# EAGLE design Apo Board 2017 ATmega328 (EAGLE 7.3.0)
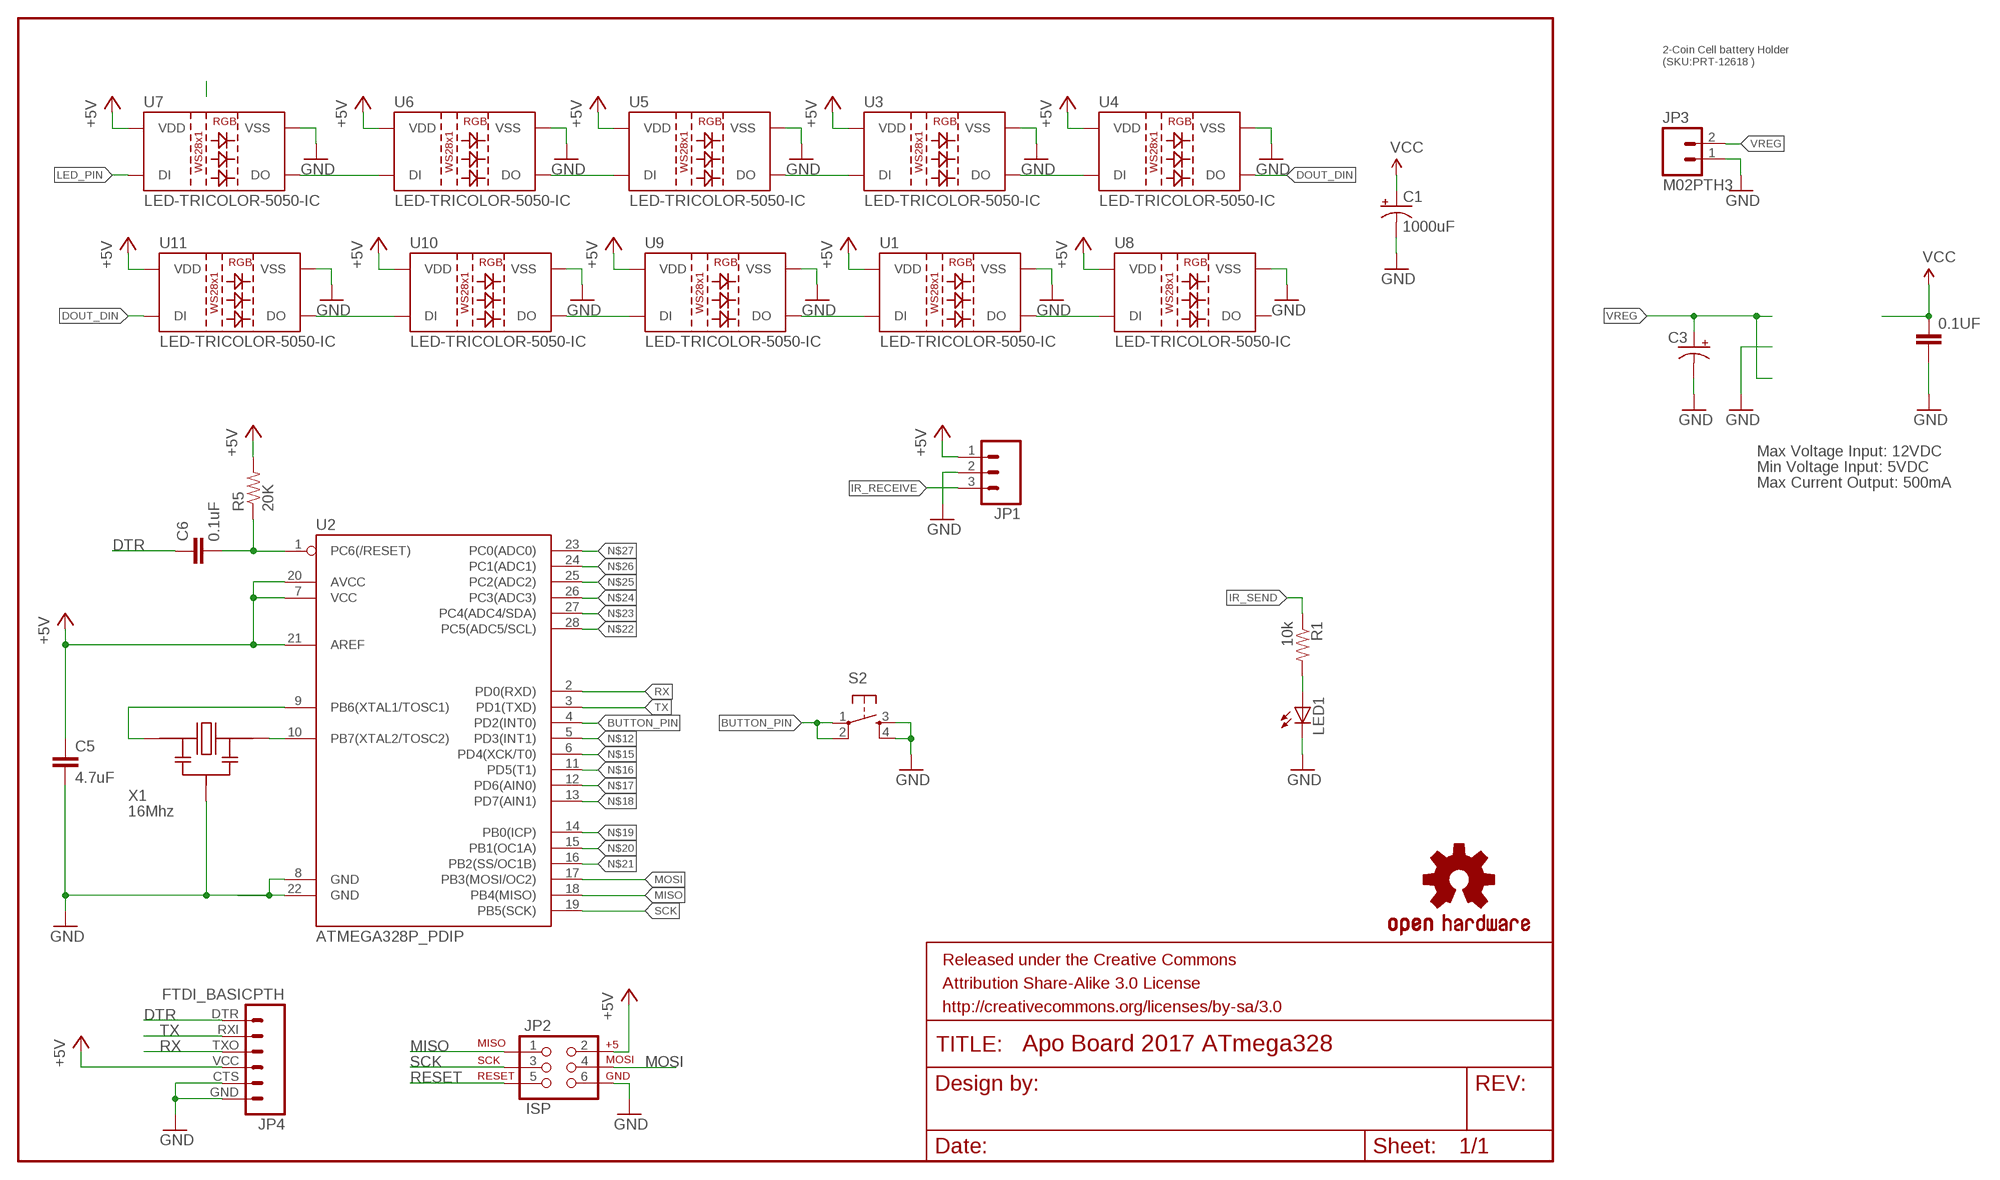
[diagram p0: schematic, sheet 1]

## Parts
0.1UF  CAPKIT  [CAP-PTH-SMALL-KIT]
C1  1000uF  CAP_POLPTH2  [CPOL-RADIAL-10UF-25V]
C3  CAP_POLPTH2  [CPOL-RADIAL-10UF-25V]
C5  4.7uF  CAPKIT  [CAP-PTH-SMALL-KIT]
C6  0.1uF  CAPKIT  [CAP-PTH-SMALL-KIT]
FRAME1  FRAME-LETTER  [CREATIVE_COMMONS]
JP1  M03PTH  [1X03]
JP2  ISP  AVR_SPI_PRG_6PTH  [2X3]
JP3  M02PTH3  [1X02_LONGPADS]
JP4  FTDI_BASICPTH  [FTDI_BASIC]
LED1  LED5MM  [LED5MM]
LOGO1  OSHW-LOGOS  [OSHW-LOGO-S]
R1  10k  RESISTORPTH-1/4W  [AXIAL-0.4]
R5  20K  RESISTORKIT  [AXIAL-0.3-KIT]
S2  TAC_SWITCHPTH  [TACTILE-PTH]
U1  LED-TRICOLOR-5050-IC  [LED-RGB-THRU]
U2  ATMEGA328P_PDIP  [DIL28-3]
U3  LED-TRICOLOR-5050-IC  [LED-RGB-THRU]
U4  LED-TRICOLOR-5050-IC  [LED-RGB-THRU]
U5  LED-TRICOLOR-5050-IC  [LED-RGB-THRU]
U6  LED-TRICOLOR-5050-IC  [LED-RGB-THRU]
U7  LED-TRICOLOR-5050-IC  [LED-RGB-THRU]
U8  LED-TRICOLOR-5050-IC  [LED-RGB-THRU]
U9  LED-TRICOLOR-5050-IC  [LED-RGB-THRU]
U10  LED-TRICOLOR-5050-IC  [LED-RGB-THRU]
U11  LED-TRICOLOR-5050-IC  [LED-RGB-THRU]
X1  16Mhz  CERAMIC_RESONATOR  [CERAMIC_RESONATOR_ZTT]

## Nets
+5V: C5.1 JP1.1 JP2.2 JP4.VCC R5.P$2 U1.2(VDD) U2.7(VCC) U2.20(AVCC) U2.21(AREF) U3.2(VDD) U4.2(VDD) U5.2(VDD) U6.2(VDD) U7.2(VDD) U8.2(VDD) U9.2(VDD) U10.2(VDD) U11.2(VDD)
BUTTON_PIN: S2.1 S2.2 U2.4(PD2(INT0))
DOUT_DIN: U4.4(DO) U11.1(DI)
DTR: C6.1 JP4.DTR
GND: 0.1UF.2 C1.2(-) C3.2(-) C5.2 JP1.2 JP2.6 JP3.1 JP4.CTS JP4.GND LED1.K(C) S2.3 S2.4 U1.3(VSS) U2.8(GND) U2.22(GND) U3.3(VSS) U4.3(VSS) U5.3(VSS) U6.3(VSS) U7.3(VSS) U8.3(VSS) U9.3(VSS) U10.3(VSS) U11.3(VSS) X1.P$2
IR_RECEIVE: JP1.3
IR_SEND: R1.P$1
LED_PIN: U7.1(DI)
MISO: JP2.1 U2.18(PB4(MISO))
MOSI: JP2.4 U2.17(PB3(MOSI/OC2))
N$1: U6.1(DI) U7.4(DO)
N$2: U5.1(DI) U6.4(DO)
N$3: LED1.A R1.P$2
N$4: U2.9(PB6(XTAL1/TOSC1)) X1.P$1
N$5: U3.1(DI) U5.4(DO)
N$6: U3.4(DO) U4.1(DI)
N$7: U2.10(PB7(XTAL2/TOSC2)) X1.P$3
N$9: U10.1(DI) U11.4(DO)
N$10: C6.2 R5.P$1 U2.1(PC6(/RESET))
N$11: U9.1(DI) U10.4(DO)
N$12: U2.5(PD3(INT1))
N$13: U1.1(DI) U9.4(DO)
N$14: U1.4(DO) U8.1(DI)
N$15: U2.6(PD4(XCK/T0))
N$16: U2.11(PD5(T1))
N$17: U2.12(PD6(AIN0))
N$18: U2.13(PD7(AIN1))
N$19: U2.14(PB0(ICP))
N$20: U2.15(PB1(OC1A))
N$21: U2.16(PB2(SS/OC1B))
N$22: U2.28(PC5(ADC5/SCL))
N$23: U2.27(PC4(ADC4/SDA))
N$24: U2.26(PC3(ADC3))
N$25: U2.25(PC2(ADC2))
N$26: U2.24(PC1(ADC1))
N$27: U2.23(PC0(ADC0))
RESET: JP2.5
RX: JP4.TXO U2.2(PD0(RXD))
SCK: JP2.3 U2.19(PB5(SCK))
TX: JP4.RXI U2.3(PD1(TXD))
VCC: 0.1UF.1 C1.1(+)
VREG: C3.1(+) JP3.2
Unconnected: U8.4(DO)

## Notes on the sheet
- 2-Coin Cell battery Holder
  (SKU:PRT-12618 )
- Max Voltage Input: 12VDC
- Min Voltage Input: 5VDC
- Max Current Output: 500mA

## Library data of the parts
0.1UF = SparkFun-Capacitors:CAP: Capacitor Standard 0603 ceramic capacitor, and 0.1" leaded capacitor.
C1 C3 = SparkFun-Capacitors:CAP_POL: Capacitor Polarized These are standard SMD and PTH capacitors. Normally 10uF, 47uF, and 100uF in electrolytic and tantalum varieties. Always verify the external diameter of the through hole cap, it varies with capacity, voltage, and manufacturer. The EIA devices should be standard.
C5 C6 = SparkFun-Passives:CAP: Capacitor Standard 0603 ceramic capacitor, and 0.1" leaded capacitor.
FRAME1 = SparkFun-Aesthetics:FRAME-LETTER: Schematic Frame Standard 8.5x11 US Letter frame
JP1 = SparkFun-Connectors:M03: Header 3 Standard 3-pin 0.1" header. Use with straight break away headers (SKU : PRT-00116), right angle break away headers (PRT-00553), swiss pins (PRT-00743), machine pins (PRT-00117), and female headers (PRT-00115). Molex polarized connector foot print use with SKU : PRT-08232 with associated crimp pins and housings.
JP2 = SparkFun:AVR_SPI_PRG_6: AVR ISP 6 Pin This is the reduced ISP connector for AVR programming. Common on Arduino. This footprint will take up less PCB space and can be used with a 10-pin to 6-pin adapter such as SKU: BOB-08508
JP3 = SparkFun-Connectors:M02: Standard 2-pin 0.1" header. Use with - straight break away headers ( PRT-00116) - right angle break away headers (PRT-00553) - swiss pins (PRT-00743) - machine pins (PRT-00117) - female headers (PRT-00115) Molex polarized connector foot print use with: PRT-08233 with associated crimp pins and housings. 2.54_SCREWTERM for use with PRT-10571. 3.5mm Screw Terminal footprints for PRT-08084 5mm Screw Terminal footprints for use with PRT-08433
JP4 = SparkFun-Connectors:FTDI_BASIC: FTDI Basic header with labels
LED1 = SparkFun-LED:LED: LEDs Standard schematic elements and footprints for 5mm, 3mm, 1206, and 0603 sized LEDs. 5mm - Spark Fun Electronics SKU : COM-00529 (and others)
LOGO1 = SparkFun-Aesthetics:OSHW-LOGO: Open Source Hardware Logo This logo indicates the piece of hardware it is found on incorporates a OSHW license and/or adheres to the definition of open source hardware found here: http://freedomdefined.org/OSHW
R1 = SparkFun-Resistors:RESISTOR: Resistor Basic schematic elements and footprints for 0603, 1206, and PTH resistors.
R5 = SparkFun-Passives:RESISTOR: Resistor Basic schematic elements and footprints for 0603, 1206, and PTH resistors.
S2 = SparkFun-Electromechanical:TAC_SWITCH: Momentary Switch Button commonly used for reset or general input. Spark Fun Electronics SKU : COM-00097 SMT- SWCH-08247
U1 U3-U11 = SparkFun-LED:LED-TRICOLOR-5050-IC: WS2811 RGB LED w/driver 5x5mm SMD LED with built-in controller IC. DIO-11598
U2 = SparkFun-DigitalIC:ATMEGA328P_PDIP: uC used in the Arduino 32kb flash, 1k EEPROM, 2k SRAM This is the through-hole version of this chip.
X1 = 1_Dan Master:CERAMIC_RESONATOR

## Net classes
0 default: width 0.203 mm
3 ButtonSignal: width 0.254 mm

## Board
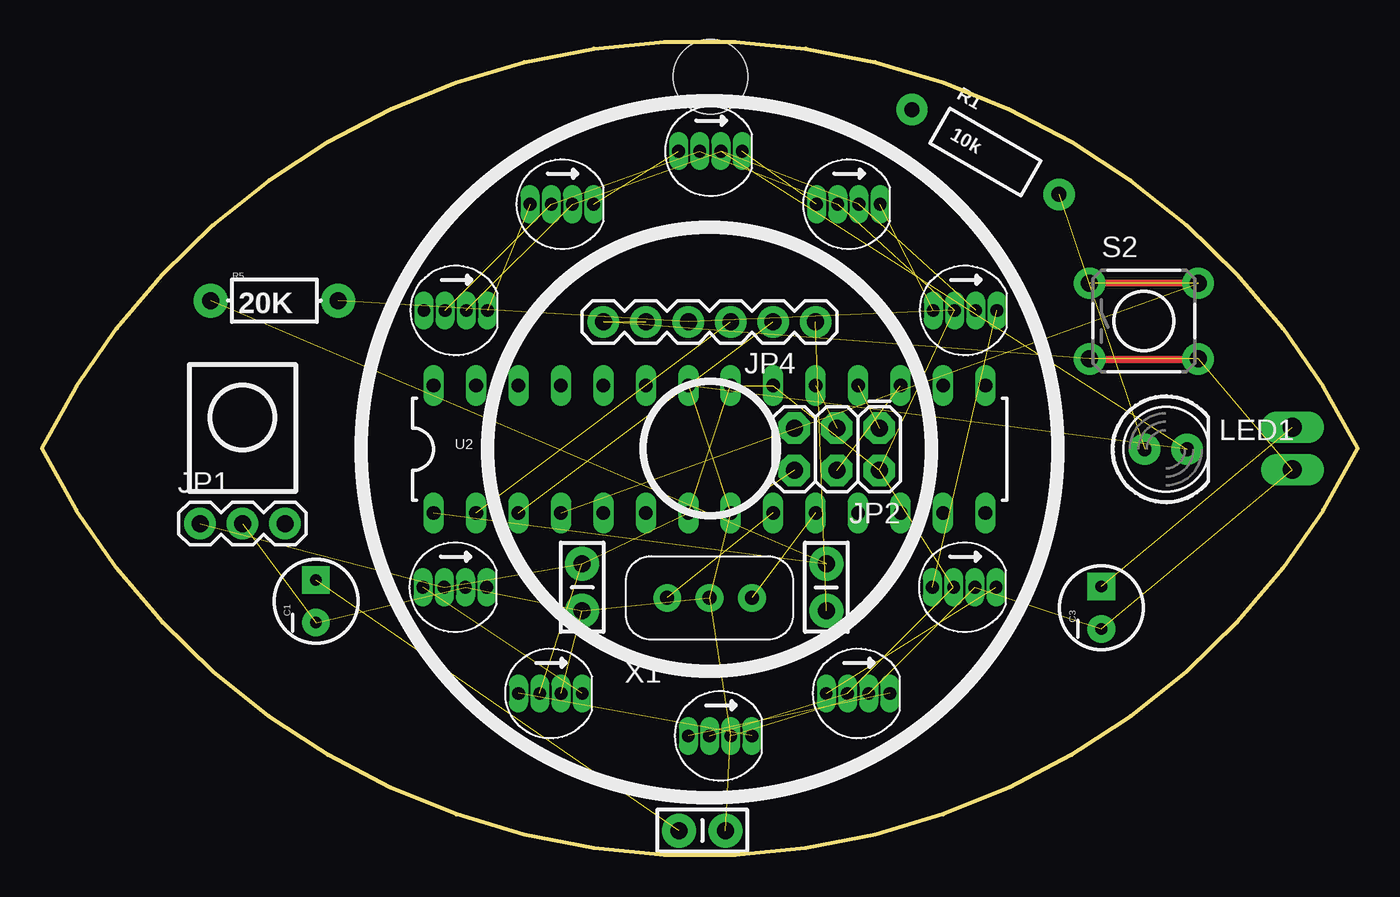
[diagram p1: board, top side]
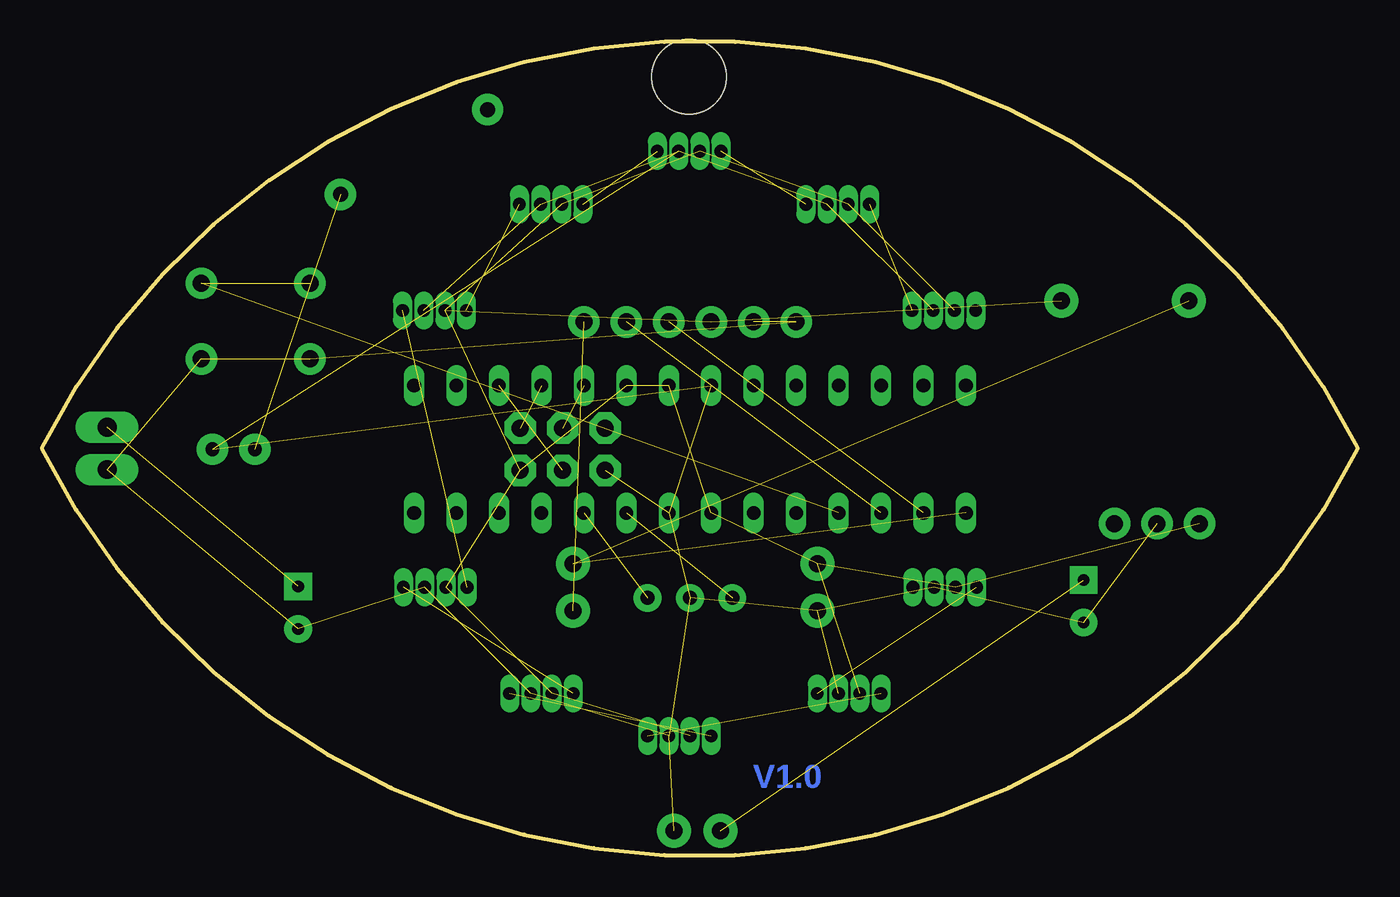
[diagram p2: board, bottom side, seen from below]

Size 78.74 x 48.64 mm. Coordinates in mm from the lower left corner, seen from the top.
Outline: 0,24.32 arc-127 78.74,24.32 arc-127 0,24.32
Copper layers (1*16): Top 0.035mm / dielectric 1.5mm / Bottom 0.035mm
Design rules "SparkFun-2-layer-TIGHT": minimum track width 7mil, minimum drill 15mil, track to track 7mil, track to pad 7mil, pad to pad 7mil, via to via 7mil, smd to smd 7mil, copper to edge 7mil, drill to drill 7mil, minimum pad ring 7mil, minimum via ring 7mil, stop-mask expansion 4mil, vias tented up to drill 25mil, thermal gap 10mil
Holes 4.45 mm at 40.01,46.55

### Footprints (pad centres in the part's own frame; a part is rotated, then mirrored left to right if it is on the bottom)
CAP-PTH-SMALL-KIT = drill 1.016 pad 2.032: 1 -1.397,0; 2 1.397,0
CPOL-RADIAL-10UF-25V = drill 0.7 pad 1.651 square: 1 1.27,0 | drill 0.7 pad 1.651: 2 -1.27,0
1X03 = drill 1.016 pad 1.88: 1 0,0; 2 2.54,0; 3 5.08,0
2X3 = drill 1.016 pad 1.88 octagon: 1 0,0; 2 0,2.54; 3 2.54,0; 4 2.54,2.54; 5 5.08,0; 6 5.08,2.54
1X02_LONGPADS = drill 1.118 pad 1.88 long: 1 0,0; 2 2.54,0
FTDI_BASIC = drill 1.016 pad 1.88: CTS 10.16,0; DTR 0,0; GND 12.7,0; RXI 2.54,0; TXO 5.08,0; VCC 7.62,0
LED5MM = drill 0.813 pad 1.88: A -1.27,0; K 1.27,0
AXIAL-0.4 = drill 0.9 pad 1.88: P$1 -5.08,0; P$2 5.08,0
AXIAL-0.3-KIT = drill 1.016 pad 2.032: P$1 -3.81,0; P$2 3.81,0
TACTILE-PTH = drill 1.016 pad 1.88: 1 -3.251,2.261; 2 3.251,2.261; 3 -3.251,-2.261; 4 3.251,-2.261
LED-RGB-THRU = drill 0.762 pad 0.889 long: 1 1.905,0; 2 0.635,0; 3 -0.635,0; 4 -1.905,0
DIL28-3 = drill 0.813 long: 1 -16.51,-3.81; 2 -13.97,-3.81; 3 -11.43,-3.81; 4 -8.89,-3.81; 5 -6.35,-3.81; 6 -3.81,-3.81; 7 -1.27,-3.81; 8 1.27,-3.81; 9 3.81,-3.81; 10 6.35,-3.81; 11 8.89,-3.81; 12 11.43,-3.81; 13 13.97,-3.81; 14 16.51,-3.81; 15 16.51,3.81; 16 13.97,3.81; 17 11.43,3.81; 18 8.89,3.81; 19 6.35,3.81; 20 3.81,3.81; 21 1.27,3.81; 22 -1.27,3.81; 23 -3.81,3.81; 24 -6.35,3.81; 25 -8.89,3.81; 26 -11.43,3.81; 27 -13.97,3.81; 28 -16.51,3.81
CERAMIC_RESONATOR_ZTT = drill 0.838 pad 1.651: P$1 -2.54,0; P$2 0,0; P$3 2.54,0

### Placement (x,y rotation side)
0.1UF  39.52,1.46 0 top
C1  16.41,15.18 90 top
C3  63.4,14.8 90 top
C5  32.33,16.02 270 top
C6  46.94,16.02 90 top
FRAME1  23.22,-5.91 0 top  (outside the outline)
JP1  9.47,19.83 0 top
JP2  50.11,25.54 180 top
JP3  74.83,23.05 90 top
JP4  46.3,31.89 180 top
LED1  67.26,24.27 0 top
LOGO1  -19.69,40.83 0 bottom  (outside the outline)
R1  56.46,42.05 330 top
R5  13.92,33.16 0 top
S2  65.94,31.94 0 top
U1  30.43,9.67 180 top
U2  39.95,24.27 0 top
U3  48.26,38.93 180 top
U4  55.25,32.58 180 top
U5  40.01,42.1 180 top
U6  31.12,38.93 180 top
U7  24.77,32.58 180 top
U8  24.71,16.02 180 top
U9  40.59,7.13 180 top
U10  48.84,9.67 180 top
U11  55.19,16.02 180 top
X1  39.95,15.38 0 top

### Tracks (layer width: path | path; a pad name or v marks a point on that pad's centre or on a via)
+5V  (17 unrouted)
BUTTON_PIN  (2 unrouted)
DOUT_DIN  (1 unrouted)
DTR  (1 unrouted)
GND  (24 unrouted)
  pour Top (isolate 0.305): -5.08,52.26 -22.23,46.55 -22.86,-6.79 -6.98,-1.08
  pour Bottom (isolate 0.305): -5.08,50.36 -22.23,52.26 -22.86,1.46 -5.71,-0.44
MISO  (1 unrouted)
MOSI  (1 unrouted)
N$1  (1 unrouted)
N$2  (1 unrouted)
N$3  (1 unrouted)
N$4  (1 unrouted)
N$5  (1 unrouted)
N$6  (1 unrouted)
N$7  (1 unrouted)
N$9  (1 unrouted)
N$10  (2 unrouted)
N$11  (1 unrouted)
N$13  (1 unrouted)
N$14  (1 unrouted)
RX  (1 unrouted)
SCK  (1 unrouted)
TX  (1 unrouted)
VCC  (1 unrouted)
VREG  (1 unrouted)

### Text on the board
Bottom: V1.0